# EAGLE design nv-h5b (EAGLE 9.5.2)
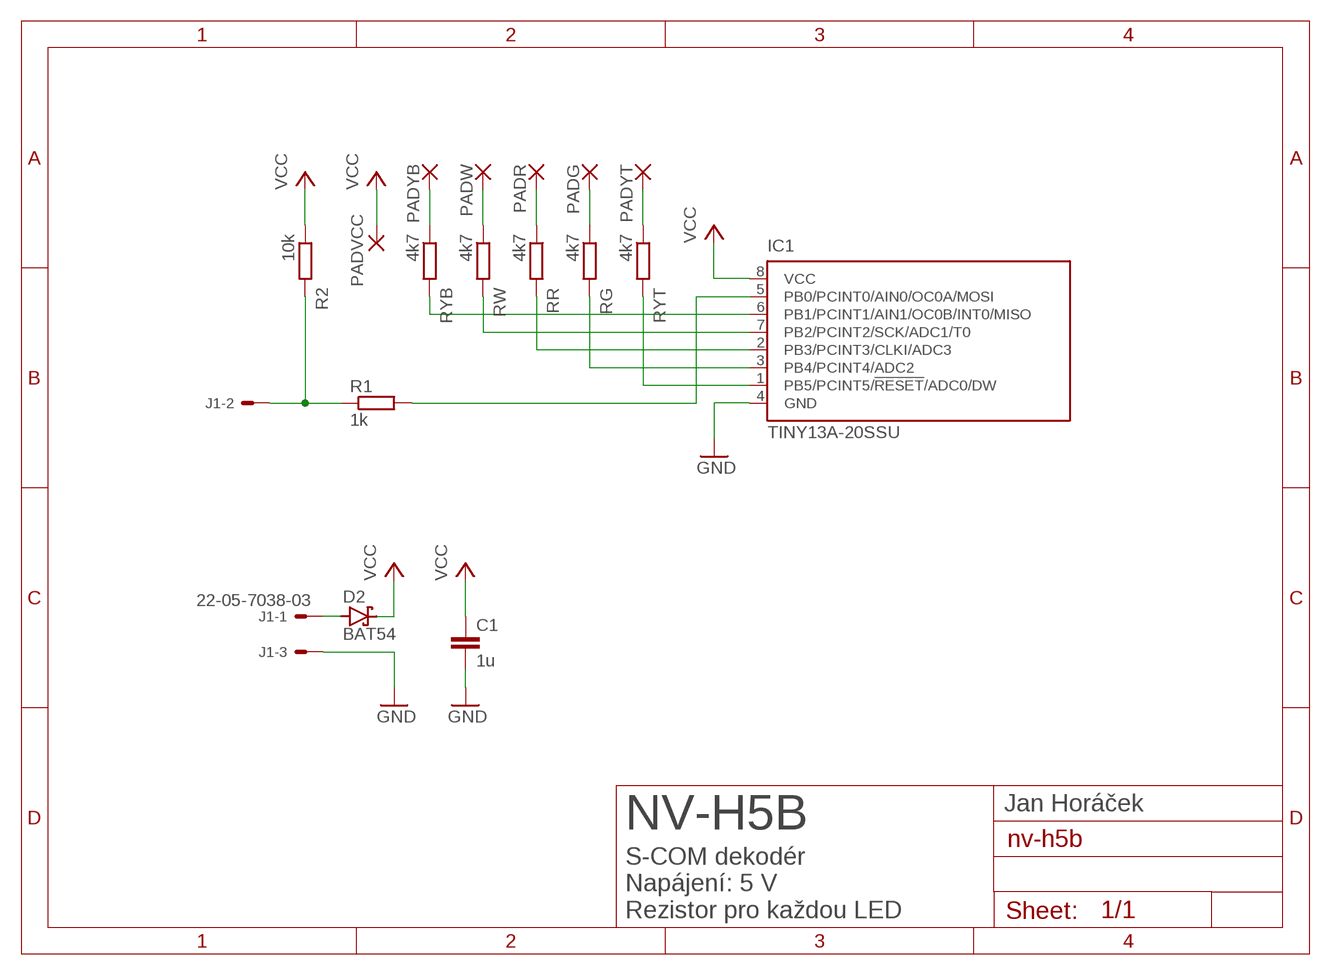
[diagram p0: schematic, sheet 1]

## Parts
C1  1u  C-EUC0805  [C0805]
D2  BAT54  [SOT23]
IC1  TINY13A-20SSU  TINY13-20SSU  [8S1]
J1  22-05-7038-03  [7395-03]
PADG  SMD3  [SMD1,778-5,08]
PADR  SMD3  [SMD1,778-5,08]
PADVCC  SMD3  [SMD1,778-5,08]
PADW  SMD3  [SMD1,778-5,08]
PADYB  SMD3  [SMD1,778-5,08]
PADYT  SMD3  [SMD1,778-5,08]
R1  1k  R-EU_R0805  [R0805]
R2  10k  R-EU_R0805  [R0805]
RG  4k7  R-EU_R0805  [R0805]
RR  4k7  R-EU_R0805  [R0805]
RW  4k7  R-EU_R0805  [R0805]
RYB  4k7  R-EU_R0805  [R0805]
RYT  4k7  R-EU_R0805  [R0805]

## Nets
DATAIN: J1.2 R1.1 R2.2
DATAIN_: IC1.5(PB0/PCINT0/AIN0/OC0A/MOSI) R1.2
GND: C1.2 IC1.4(GND) J1.3
GREEN: PADG.1(P) RG.1
N$3: IC1.6(PB1/PCINT1/AIN1/OC0B/INT0/MISO) RYB.2
N$4: IC1.3(PB4/PCINT4/ADC2) RG.2
N$5: IC1.1(PB5/PCINT5/!RESET!/ADC0/DW) RYT.2
N$6: IC1.7(PB2/PCINT2/SCK/ADC1/T0) RW.2
N$7: IC1.2(PB3/PCINT3/CLKI/ADC3) RR.2
RED: PADR.1(P) RR.1
VCC: C1.1 D2.3(C) IC1.8(VCC) PADVCC.1(P) R2.1
VIN: D2.1(A) J1.1
WHITE: PADW.1(P) RW.1
YEL-BOT: PADYB.1(P) RYB.1
YEL-TOP: PADYT.1(P) RYT.1

## Notes on the sheet
- Jan Horáček
- NV-H5B
- S-COM dekodér
  Napájení: 5 V
  Rezistor pro každou LED

## Library data of the parts
C1 = rcl:C-EU: CAPACITOR, European symbol
D2 = diode:BAT54: Schottky Diodes Source: Fairchild .. BAT54.pdf
IC1 = atmel:TINY13: 8-bit AVR Microcontroller with 1K Bytes In-System Programmable Flash Source: http://www.atmel.com/dyn/resources/prod_documents/2535S.pdf; MPN: ATTINY13-20SSU; OC_FARNELL: 1455133; OC_NEWARK: 58M3771
J1 = con-molex:22-?-03: CONNECTOR wire to board 2.54 mm (.1 inch) pitch header; MF: MOLEX; OC_FARNELL: unknown; OC_NEWARK: unknown
PADG PADR PADVCC PADW PADYB PADYT = wirepad:SMD3
R1 R2 RG RR RW RYB RYT = rcl:R-EU_: RESISTOR, European symbol

## Net classes
0 default: width 0.305 mm

## Board
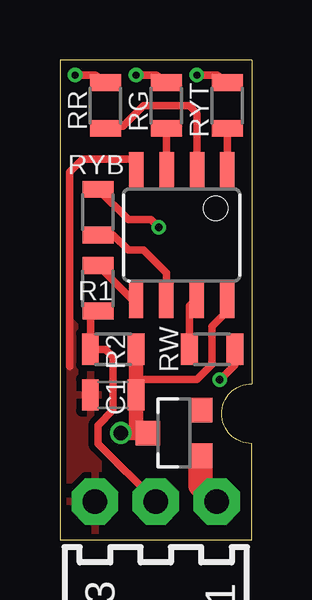
[diagram p1: board, top side]
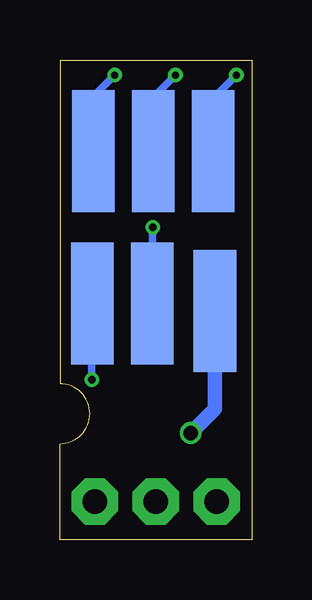
[diagram p2: board, bottom side, seen from below]

Size 8 x 20 mm. Coordinates in mm from the lower left corner, seen from the top.
Outline: 0,0 8,0 8,4 arc-180 8,6.5 8,20 0,20 0,0
Copper layers (1*16): Top 0.035mm / dielectric 1.5mm / Bottom 0.035mm
Design rules "SeeedStudio_2layer_DRU_no_angle_20140221": minimum track width 6mil, minimum drill 12mil, track to track 6mil, track to pad 6mil, pad to pad 6mil, via to via 6mil, smd to smd 0mil, copper to edge 10mil, drill to drill 10mil, minimum pad ring 10mil, minimum via ring 6mil, stop-mask expansion 2mil, vias tented up to drill 100mil, thermal gap 10mil

### Footprints (pad centres in the part's own frame; a part is rotated, then mirrored left to right if it is on the bottom)
C0805 = smd 0.7 x 1.3: 1 -0.95,0; 2 0.95,0
SOT23 = smd 1.016 x 1.016: 1 -0.95,-1.1; 2 0.95,-1.1; 3 0,1.1
8S1 = smd 0.6 x 1.6: 1 -1.905,-2.654; 2 -0.645,-2.654; 3 0.625,-2.654; 4 1.895,-2.654; 5 1.905,2.654; 6 0.635,2.654; 7 -0.635,2.654; 8 -1.905,2.654
7395-03 = drill 1.016 pad 1.93 octagon: 1 2.54,0; 2 0,0; 3 -2.54,0
SMD1,778-5,08 = smd 1.778 x 5.08: 1 0.889,2.54
R0805 = smd 0.7 x 1.3: 1 -0.95,0; 2 0.95,0

### Placement (x,y rotation side)
C1  2.22,6.03 180 top
D2  4.76,4.45 90 top
IC1  5.08,12.7 180 top
J1  4,1.59 0 top
PADG  5,13.65 0 bottom
PADR  2.5,13.65 0 bottom
PADVCC  2.42,6.99 0 bottom
PADW  7.54,7.3 0 bottom
PADYB  5.04,7.3 0 bottom
PADYT  7.5,13.65 0 bottom
R1  1.59,10.48 90 top
R2  2.22,7.94 180 top
RG  4.45,18.1 270 top
RR  1.91,18.1 270 top
RW  6.35,7.94 180 top
RYB  1.59,13.65 270 top
RYT  6.99,18.1 270 top

### Tracks (layer width: path | path; a pad name or v marks a point on that pad's centre or on a via)
DATAIN
  Top 0.305: 1.27,8.04 R2.2 | R2.2 1.91,7.94 2.22,7.62 2.22,5.4 1.59,4.76 1.59,4 J1.2 | R2.2 1.27,9.21 R1.1
DATAIN_
  Top 0.305: R1.2 2.97,10.05 IC1.5
GND
  Top 0.305: IC1.4 3.17,15.36 3.17,15.88 0.95,15.88 0.41,15.33 0.41,7.21
  pour Top (isolate 0.254): 0,0 1.59,0 1.59,7.94 0,9.53
GREEN  (via drill 0.3)
  Top 0.305: RG.1 4.03,19.37 v3.17,19.37
  Bottom 0.305: PADG.1 4.11,18.43 v3.17,19.37
N$3
  Top 0.305: IC1.6 4.45,11.11 3.49,12.06 2.86,12.06 2.22,12.7 RYB.2
N$4
  Top 0.305: RG.2 4.46,17.24 IC1.3
N$5
  Top 0.305: IC1.1 RYT.2
N$6
  Top 0.305: RW.2 5.4,9.73 IC1.7
N$7
  Top 0.305: IC1.2 5.72,17.77 5.4,18.1 3.49,18.1 2.64,17.25 RR.2
RED  (via drill 0.3)
  Top 0.305: RR.1 1.49,19.37 v0.64,19.37
  Bottom 0.305: PADR.1 1.61,18.39 v0.64,19.37
VCC  (via drill 0.6)
  Top 0.305: IC1.8 6.99,9.53 6.35,8.89 6.35,7.3 5.71,6.67 3.17,6.67 | D2.3 3.35,4.45 3.17,4.62
  Top 0.61: v2.54,4.45 D2.3 | R2.1 3.17,6.67 C1.1 3.17,4.62
  Bottom 0.61: PADVCC.1 1.53,5.45 v2.54,4.45
VIN
  Top 1.016: J1.1 5.86,2.27 D2.1
WHITE  (via drill 0.3)
  Top 0.305: RW.1 7.3,7.29 v6.67,6.66 v6.67,6.67
  Bottom 0.305: v6.67,6.67 6.67,9.83 PADW.1
YEL-BOT  (via drill 0.3)
  Top 0.305: RYB.1 2.85,13.34 3.81,13.34 v4.13,13.02
  Bottom 0.305: 4.15,9.24 PADYB.1 4.13,9.87 v4.13,13.02
YEL-TOP  (via drill 0.3)
  Top 0.305: RYT.1 6.57,19.37 v5.71,19.37
  Bottom 0.305: 6.67,16.25 PADYT.1 6.61,18.47 v5.71,19.37

### Text on the board
bValues: zelená | červ. | žl-hor. | žl-dolní | bílá | +